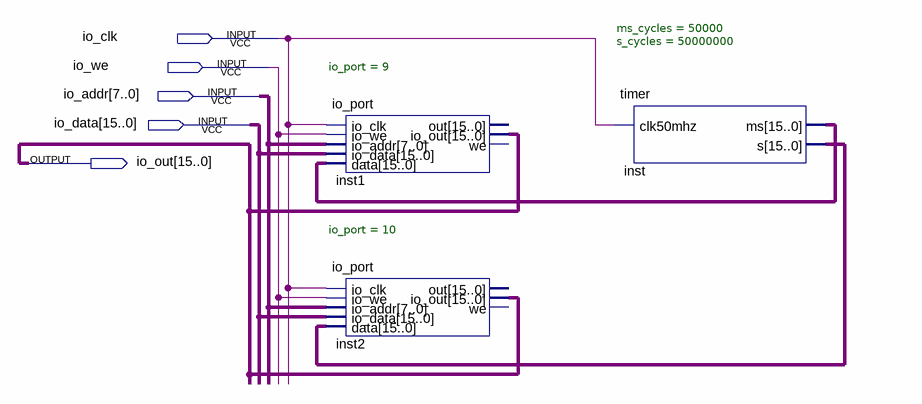
[diagram p0: schematic sheet]
// Quartus schematic time_io.bdf as structural Verilog: 3 symbols, 5 pins
module time_io (
  input  io_clk,
  input  io_we,
  input  [7:0] io_addr,
  input  [15:0] io_data,
  output [15:0] io_out
);

  wire [15:0] inst_ms, inst_s;

  io_port #(.io_port(9)) inst1 (
    .io_clk(io_clk), .io_we(io_we), .io_addr(io_addr), .io_data(io_data), .data(inst_ms), .io_out(io_out));  // open: out, we
  io_port #(.io_port(10)) inst2 (
    .io_clk(io_clk), .io_we(io_we), .io_addr(io_addr), .io_data(io_data), .data(inst_s), .io_out(io_out));  // open: out, we
  timer #(.ms_cycles(50000), .s_cycles(50000000)) inst (.clk50mhz(io_clk), .ms(inst_ms), .s(inst_s));
endmodule
